# Altium project Piscina-V.02.PrjPcb
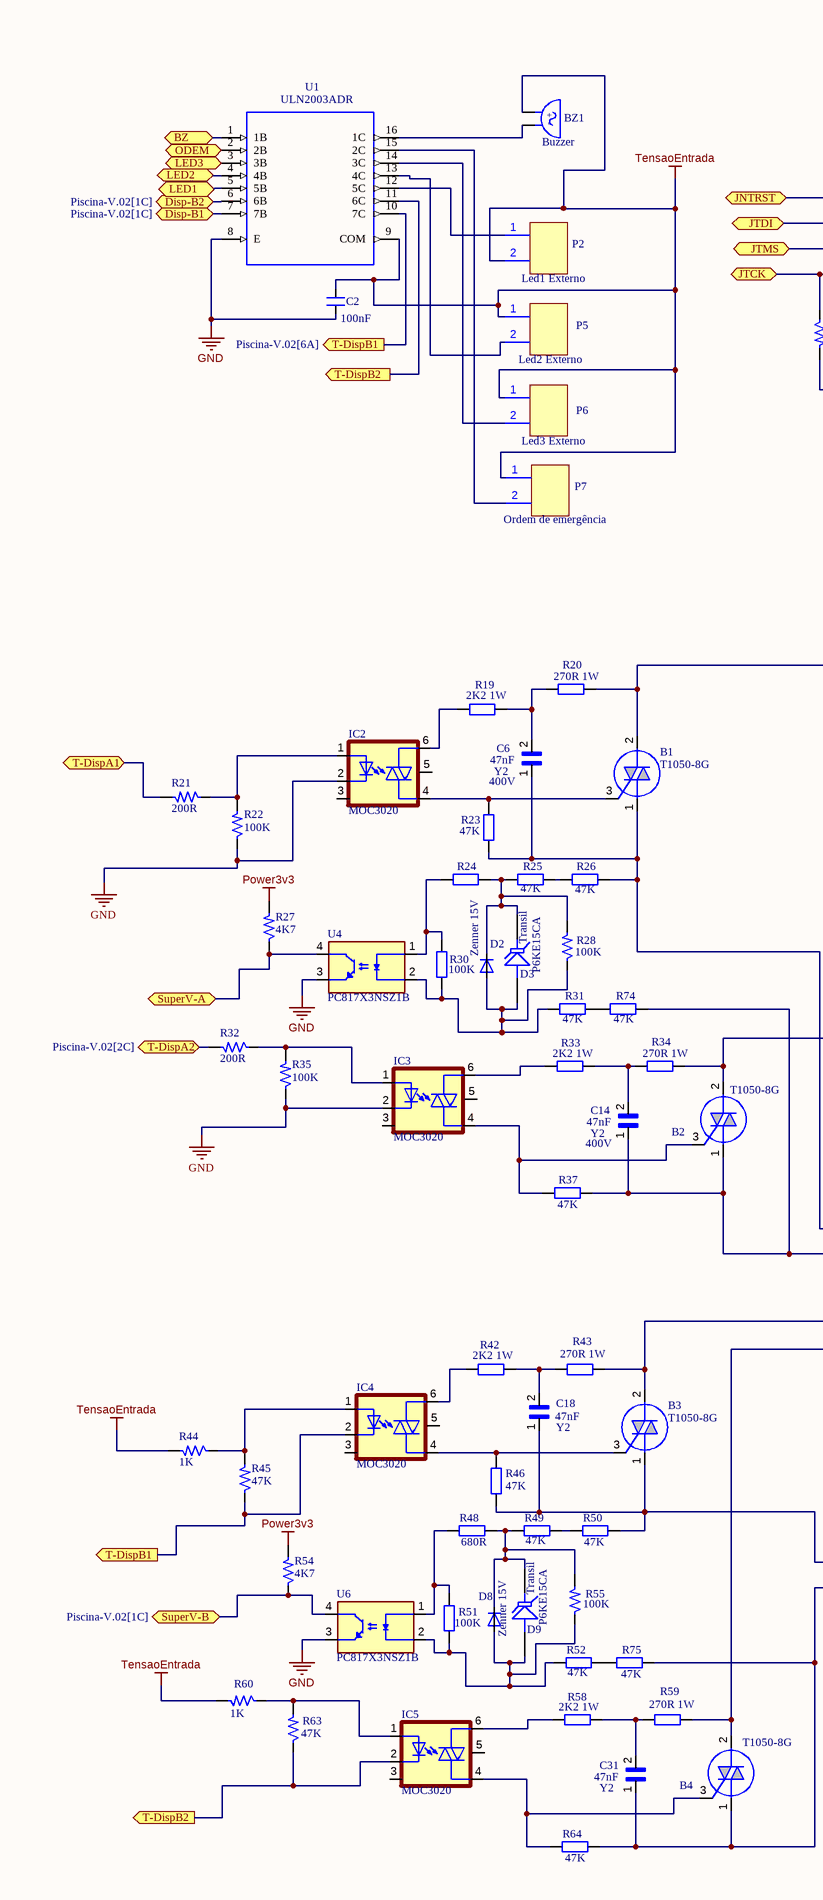
[diagram p0: Piscina-V.02.SchDoc, left]
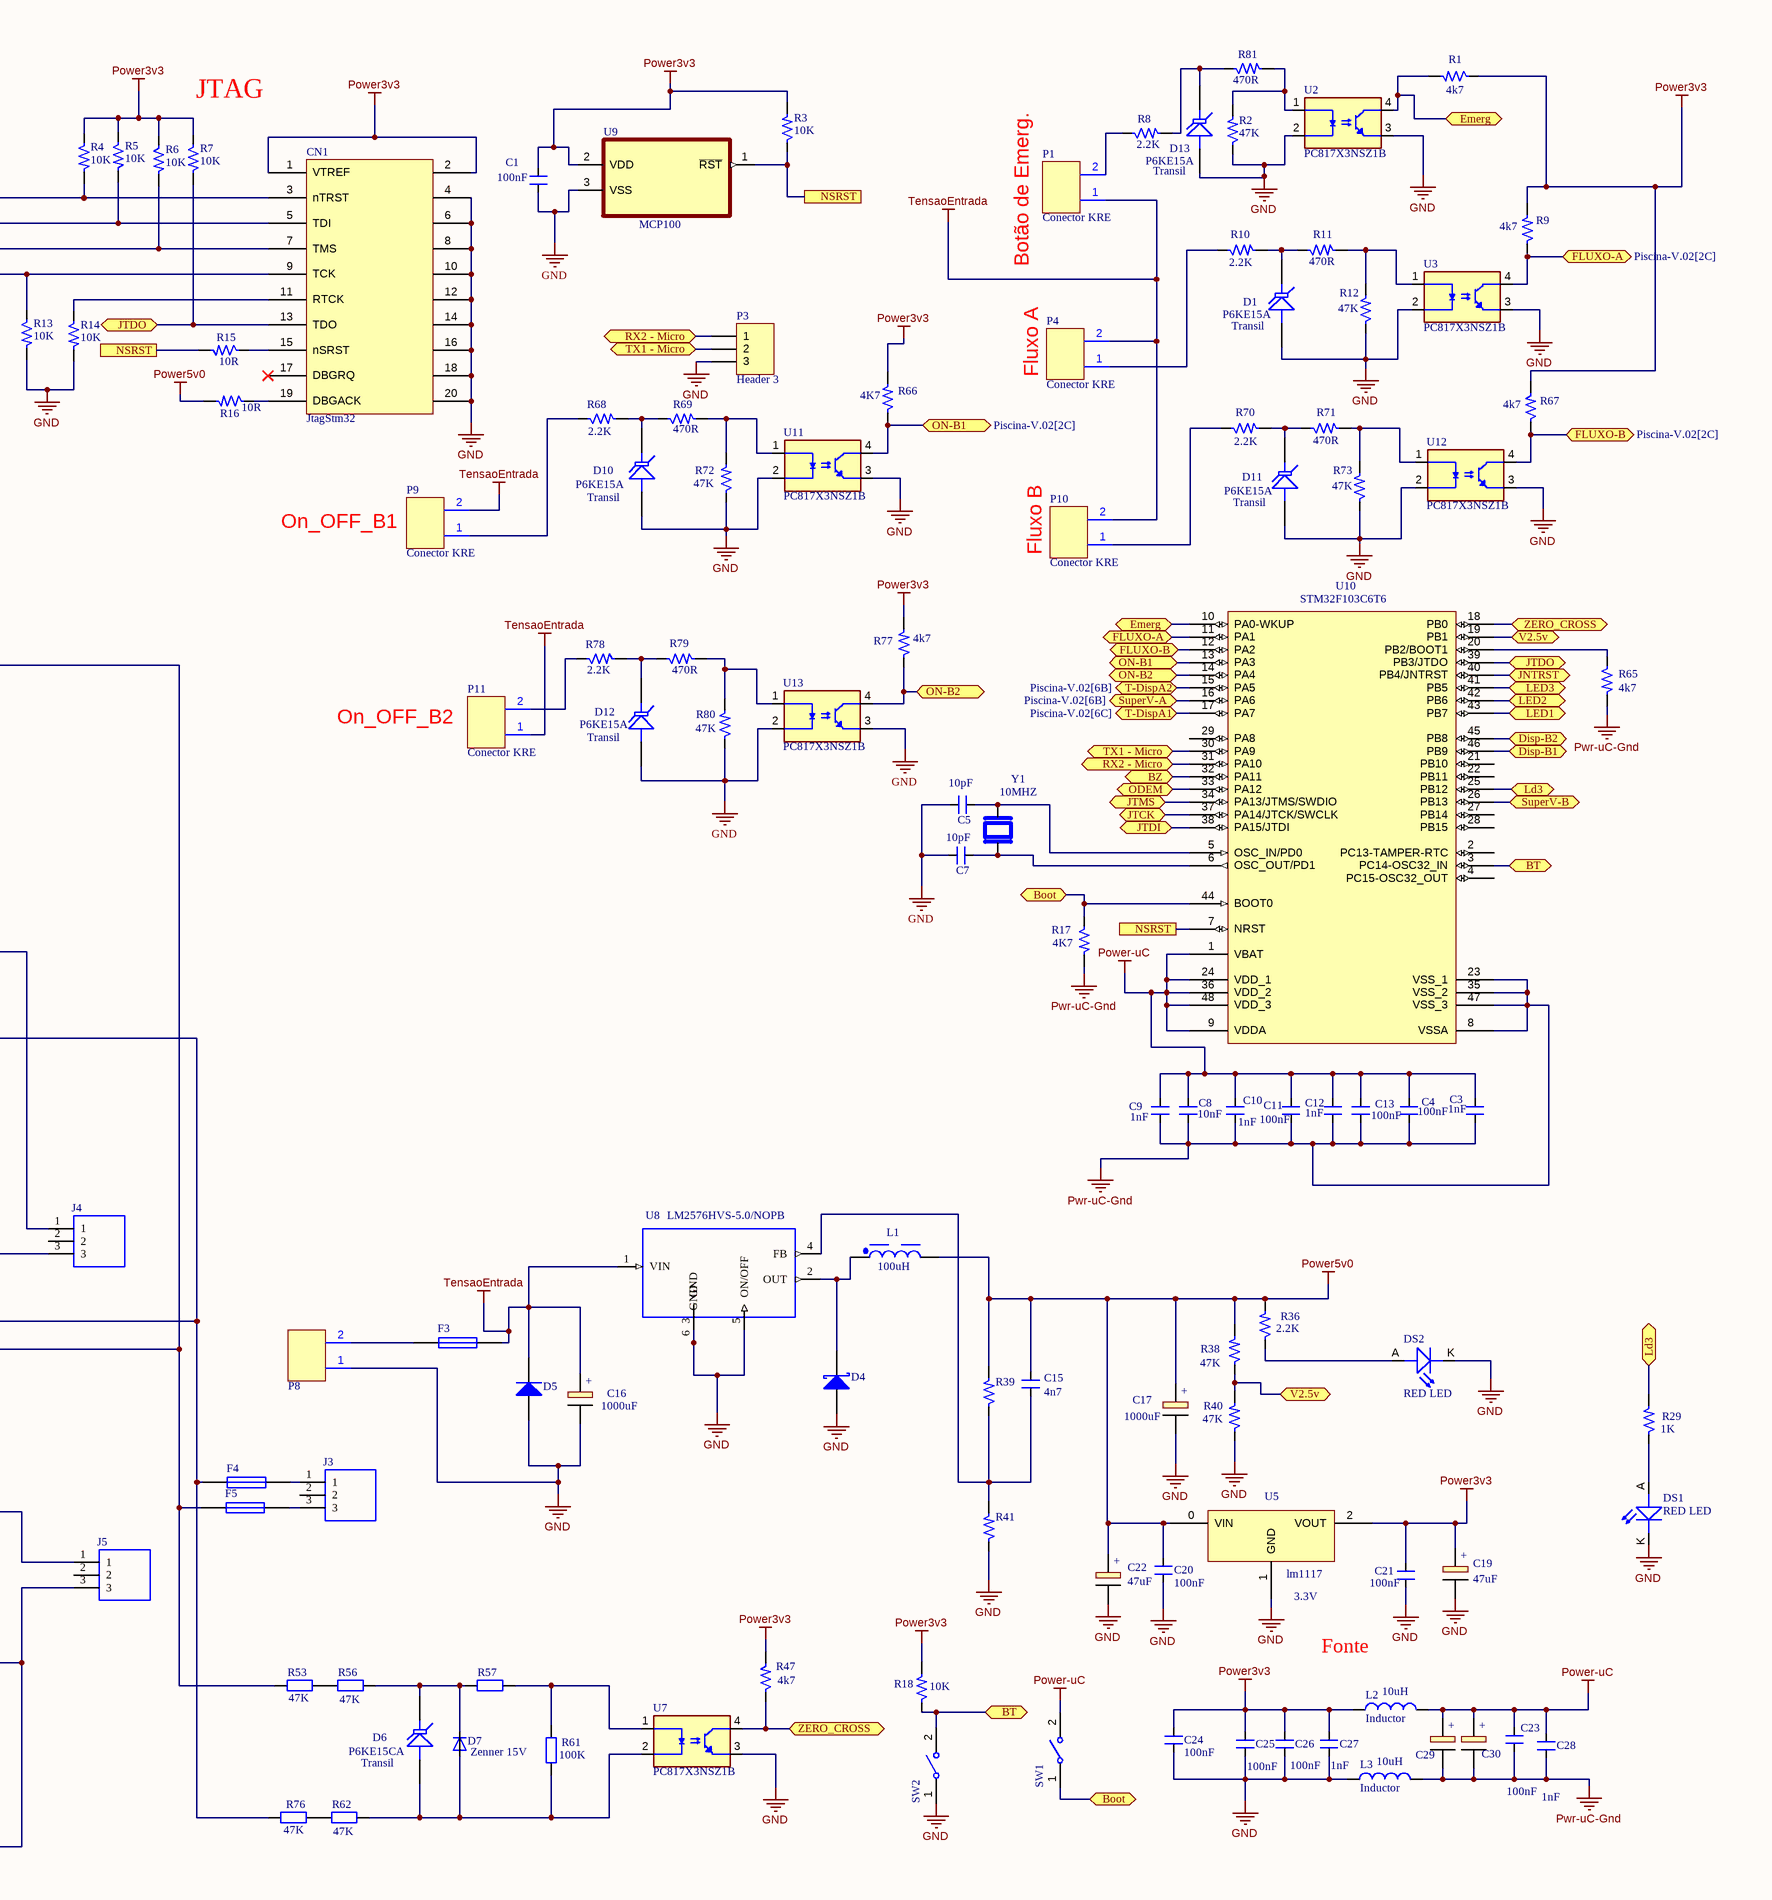
[diagram p1: Piscina-V.02.SchDoc, right]
1 sheet, 173 parts. Net scope: flat (ports and power ports of the same name join across sheets).
Board file: Piscina-V.02.PcbDoc

## Sheet Piscina-V.02.SchDoc
size C; SheetNumber: 1; SheetTotal: 1; SPICEModelCacheODWFNCHP: <root> / <DocumentId>ODWFNCHP</DocumentId> / <CacheFrame Number="0"> / <Model Name="10tq035" Kind="MDL"> / <Text>*10TQ035 MCE 3/26/98 / *Ref: IR Power Semiconductors Product Digest '94 / *MCE 35V 10A 3us pkg:TO-220 3,1 / .MODEL 10TQ035 D (IS=14.2N RS=4.2M N=1.7 BV=35 IBV=15M / + CJO=412P VJ=0.75 M=0.333 TT=4.32U EG=.69 XTI=2)</Text> / </Model> / </CacheFrame> / </root>

### Parts
B1  T1050-8G  [Triac-D²PAK]
B2  T1050-8G  [Triac-D²PAK]
B3  T1050-8G  [Triac-D²PAK]
B4  T1050-8G  [Triac-D²PAK]
BZ1  Buzzer  [Buzzer-3D]
C1  100nF  [Cap0805]
C2  100nF  [Cap0805]
C3  1nF  [Cap0805]
C4  100nF  [Cap0805]
C5  10pF  [Cap0805]
C6  47nF  [CapX2-10mm]
C7  10pF  [Cap0805]
C8  10nF  [Cap0805]
C9  1nF  [Cap0805]
C10  1nF  [Cap0805]
C11  100nF  [Cap0805]
C12  1nF  [Cap0805]
C13  100nF  [Cap0805]
C14  47nF  [CapX2-10mm]
C15  4n7  [Cap0805]
C16  1000uF  [Cap-Eletrolitico-5mm]
C17  1000uF  [Cap-Eletrolitico-5mm]
C18  47nF  [CapX2-10mm]
C19  47uF  [Cap_47uf 16V]
C20  100nF  [Cap0805]
C21  100nF  [Cap0805]
C22  47uF  [Cap_47uf 16V]
C23  100nF  [Cap0805]
C24  100nF  [Cap0805]
C25  100nF  [Cap0805]
C26  100nF  [Cap0805]
C27  1nF  [Cap0805]
C28  1nF  [Cap0805]
C29  Capacitor Eletrolitico  [Cap_47uf 16V]  (value not drawn)
C30  Capacitor Eletrolitico  [Cap_47uf 16V]  (value not drawn)
C31  47nF  [CapX2-10mm]
CN1  JtagStm32  [CN-JTAG]
D1  P6KE15A  [Diode-10mm-3D]
D2  Zenner 15V  [Diode-SOD-80]
D3  P6KE15CA  [Diode-10mm-3D]
D4  Diode 10TQ035  [MBR360]  (value not drawn)
D5  Diode 1N5408  [Diode-1N5408]  (value not drawn)
D6  P6KE15CA  [Diode-10mm-3D]
D7  Zenner 15V  [Diode-SOD-80]
D8  Zenner 15V  [Diode-SOD-80]
D9  P6KE15CA  [Diode-10mm-3D]
D10  P6KE15A  [Diode-10mm-3D]
D11  P6KE15A  [Diode-10mm-3D]
D12  P6KE15A  [Diode-10mm-3D]
D13  P6KE15A  [Diode-10mm-3D]
DS1  RED LED  [Led-smd]
DS2  RED LED  [Led-smd]
F3  Fuse 1  [PicoFuse]  (value not drawn)
F4  Fuse 1  [PicoFuse]  (value not drawn)
F5  Fuse 1  [PicoFuse]  (value not drawn)
IC2  MOC3020  [MOC3020-3D]
IC3  MOC3020  [MOC3020-3D]
IC4  MOC3020  [MOC3020-3D]
IC5  MOC3020  [MOC3020-3D]
J3  TB002-500-03OR  [Borne-3V]  (value not drawn)
J4  TB002-500-03OR  [Borne-3V]  (value not drawn)
J5  TB002-500-03OR  [Borne-3V]  (value not drawn)
L1  100uH  [Indutor SMD]
L2  Inductor  value 10uH  [Indutor_Ax]
L3  Inductor  value 10uH  [Indutor_Ax]
P1  Conector KRE  [Borne-2V]
P2  Led1 Externo  [Borne-2V]
P3  Header 3  [CN_UART]
P4  Conector KRE  [Borne-2V]
P5  Led2 Externo  [Borne-2V]
P6  Led3 Externo  [Borne-2V]
P7  Ordem de emergência  [Borne-2V]
P8  Conector KRE  [Borne-2V]  (value not drawn)
P9  Conector KRE  [Borne-2V]
P10  Conector KRE  [Borne-2V]
P11  Conector KRE  [Borne-2V]
R1  4k7  [RESC2012X65N]
R2  47K  [RESC2012X65N]
R3  10K  [RESC2012X65N]
R4  10K  [RESC2012X65N]
R5  10K  [RESC2012X65N]
R6  10K  [RESC2012X65N]
R7  10K  [RESC2012X65N]
R8  2.2K  [RESC2012X65N]
R9  4k7  [RESC2012X65N]
R10  2.2K  [RESC2012X65N]
R11  470R  [RESC2012X65N]
R12  47K  [RESC2012X65N]
R13  10K  [RESC2012X65N]
R14  10K  [RESC2012X65N]
R15  10R  [RESC2012X65N]
R16  10R  [RESC2012X65N]
R17  4K7  [RESC2012X65N]
R18  10K  [RESC2012X65N]
R19  2K2 1W  [Resistor 1-4W]
R20  270R 1W  [Resistor 1-4W]
R21  200R  [RESC2012X65N]
R22  100K  [RESC2012X65N]
R23  47K  [Resistor 1-4W]
R24  Res2  [RESC3216X71N]  (value not drawn)
R25  47K  [RESC3216X71N]
R26  47K  [RESC3216X71N]
R27  4K7  [RESC2012X65N]
R28  100K  [RESC2012X65N]
R29  1K  [RESC2012X65N]
R30  100K  [RESC2012X65N]
R31  47K  [RESC3216X71N]
R32  200R  [RESC2012X65N]
R33  2K2 1W  [Resistor 1-4W]
R34  270R 1W  [Resistor 1-4W]
R35  100K  [RESC2012X65N]
R36  2.2K  [RESC2012X65N]
R37  47K  [Resistor 1-4W]
R38  47K  [RESC2012X65N]
R39  40.2K  [RESC2012X65N]  (value not drawn)
R40  47K  [RESC2012X65N]
R41  40.2K  [RESC2012X65N]  (value not drawn)
R42  2K2 1W  [Resistor 1-4W]
R43  270R 1W  [Resistor 1-4W]
R44  1K  [RESC2012X65N]
R45  47K  [RESC2012X65N]
R46  47K  [Resistor 1-4W]
R47  4k7  [RESC2012X65N]
R48  680R  [RESC3216X71N]
R49  47K  [RESC3216X71N]
R50  47K  [RESC3216X71N]
R51  100K  [RESC2012X65N]
R52  47K  [RESC3216X71N]
R53  47K  [RESC3216X71N]
R54  4K7  [RESC2012X65N]
R55  100K  [RESC2012X65N]
R56  47K  [RESC3216X71N]
R57  Res2  [RESC3216X71N]  (value not drawn)
R58  2K2 1W  [Resistor 1-4W]
R59  270R 1W  [Resistor 1-4W]
R60  1K  [RESC2012X65N]
R61  100K  [RESC2012X65N]
R62  47K  [RESC3216X71N]
R63  47K  [RESC2012X65N]
R64  47K  [Resistor 1-4W]
R65  4k7  [RESC2012X65N]
R66  4K7  [RESC2012X65N]
R67  4k7  [RESC2012X65N]
R68  2.2K  [RESC2012X65N]
R69  470R  [RESC2012X65N]
R70  2.2K  [RESC2012X65N]
R71  470R  [RESC2012X65N]
R72  47K  [RESC2012X65N]
R73  47K  [RESC2012X65N]
R74  47K  [RESC3216X71N]
R75  47K  [RESC3216X71N]
R76  47K  [RESC3216X71N]
R77  4k7  [RESC2012X65N]
R78  2.2K  [RESC2012X65N]
R79  470R  [RESC2012X65N]
R80  47K  [RESC2012X65N]
R81  470R  [RESC2012X65N]
SW1  434121025816  [434121025816]  (value not drawn)
SW2  434121025816  [434121025816]  (value not drawn)
U1  ULN2003ADR  [ULN2003A-3D]
U2  PC817X3NSZ1B  [DIP762W50P254L495H455Q4]
U3  PC817X3NSZ1B  [DIP762W50P254L495H455Q4]
U4  PC817X3NSZ1B  [DIP762W50P254L495H455Q4]
U5  lm1117  output voltag: 3.3V  [LM1117-3D]
U6  PC817X3NSZ1B  [DIP762W50P254L495H455Q4]
U7  PC817X3NSZ1B  [DIP762W50P254L495H455Q4]
U8  LM2576HVS-5.0/NOPB  [LM2576]
U9  MCP100  [MCP100-SMD]
U10  STM32F103C6T6  [lqfp48-stm]
U11  PC817X3NSZ1B  [DIP762W50P254L495H455Q4]
U12  PC817X3NSZ1B  [DIP762W50P254L495H455Q4]
U13  PC817X3NSZ1B  [DIP762W50P254L495H455Q4]
Y1  10MHZ  [XTAL_ABLS-12.000MHz-20-B-3-H-T]

### Ports
Boot (bidir, see Piscina-V.02[2A]), Boot (bidir, see Piscina-V.02[2C]), BT (bidir, see Piscina-V.02[1C]), BT (bidir, see Piscina-V.02[2A]), BZ (bidir, see Piscina-V.02[2C]), BZ (bidir, see Piscina-V.02[6D]), Disp-B1 (bidir, see Piscina-V.02[1C]), Disp-B1 (bidir, see Piscina-V.02[6D]), Disp-B2 (bidir, see Piscina-V.02[1C]), Disp-B2 (bidir, see Piscina-V.02[6D]), Emerg (bidir, see Piscina-V.02[1D]), Emerg (bidir, see Piscina-V.02[2C]), FLUXO-A (bidir, see Piscina-V.02[1D]), FLUXO-A (bidir, see Piscina-V.02[2C]), FLUXO-B (bidir, see Piscina-V.02[1D]), FLUXO-B (bidir, see Piscina-V.02[2C]), JNTRST (bidir, see Piscina-V.02[1C]), JNTRST (bidir, see Piscina-V.02[5D]), JTCK (bidir, see Piscina-V.02[2C]), JTCK (bidir, see Piscina-V.02[5D]), JTDI (bidir, see Piscina-V.02[2C]), JTDI (bidir, see Piscina-V.02[5D]), JTDO (bidir, see Piscina-V.02[1C]), JTDO (bidir, see Piscina-V.02[4D]), JTMS (bidir, see Piscina-V.02[2C]), JTMS (bidir, see Piscina-V.02[5D]), Ld3 (bidir, see Piscina-V.02[1B]), Ld3 (bidir, see Piscina-V.02[1C]), LED1 (bidir, see Piscina-V.02[1C]), LED1 (bidir, see Piscina-V.02[6D]), LED2 (bidir, see Piscina-V.02[1C]), LED2 (bidir, see Piscina-V.02[6D]), LED3 (bidir, see Piscina-V.02[1C]), LED3 (bidir, see Piscina-V.02[6D]), NSRST (see Piscina-V.02[2C], Piscina-V.02[3D]), NSRST (see Piscina-V.02[2C], Piscina-V.02[4D]), NSRST (see Piscina-V.02[3D], Piscina-V.02[4D]), ODEM (bidir, see Piscina-V.02[2C]), ODEM (bidir, see Piscina-V.02[6D]), ON-B1 (bidir, see Piscina-V.02[2C]), ON-B1 (bidir, see Piscina-V.02[2D]), ON-B2 (bidir, see Piscina-V.02[2C]), RX2 - Micro (bidir, see Piscina-V.02[2C]), RX2 - Micro (bidir, see Piscina-V.02[3D]), SuperV-A (bidir, see Piscina-V.02[2C]), SuperV-A (bidir, see Piscina-V.02[6B]), SuperV-B (bidir, see Piscina-V.02[1C]), SuperV-B (bidir, see Piscina-V.02[6A]), T-DispA1 (bidir, see Piscina-V.02[2C]), T-DispA1 (bidir, see Piscina-V.02[6C]), T-DispA2 (bidir, see Piscina-V.02[2C]), T-DispA2 (bidir, see Piscina-V.02[6B]), T-DispB1 (out, see Piscina-V.02[6A]), T-DispB1 (out, see Piscina-V.02[6D]), T-DispB2 (out, see Piscina-V.02[6A]), T-DispB2 (out, see Piscina-V.02[6D]), TX1 - Micro (bidir, see Piscina-V.02[2C]), TX1 - Micro (bidir, see Piscina-V.02[3D]), V2.5v (bidir, see Piscina-V.02[1C]), V2.5v (bidir, see Piscina-V.02[2B]), ZERO_CROSS (bidir, see Piscina-V.02[1C]), ZERO_CROSS (bidir, see Piscina-V.02[3A])

### Nets
GND: C1.1 C2.1 C5.2 C7.2 C16.Negativo C17.Negativo C19.Negativo C20.1 C21.1 C22.Negativo C24.1 C25.1 C26.1 C27.1 CN1.4(GND) CN1.6(GND) CN1.8(GND) CN1.10(GND) CN1.12(GND) CN1.14(GND) CN1.16(GND) CN1.18(GND) CN1.20(GND) D1.1(A) D4.Anodo(Catodo) D5.1(A) D10.1(A) D11.1(A) D12.1(A) D13.1(A) DS1.K(CATHODE) DS2.K(CATHODE) IC2.2(C) IC3.2(C) L3.1 P3.3 P8.1 R2.1 R12.1 R13.2 R14.2 R22.1 R35.1 R40.1 R41.1 R72.1 R73.1 R80.1 SW2.1 U1.8(E) U2.2(CATHODE) U2.3(EMITTER) U3.2(CATHODE) U3.3(EMITTER) U4.3(EMITTER) U5.1(GND) U6.3(EMITTER) U7.3(EMITTER) U8.3(GND) U8.5(ON/OFF) U8.6(GND) U9.3(VSS) U11.2(CATHODE) U11.3(EMITTER) U12.2(CATHODE) U12.3(EMITTER) U13.2(CATHODE) U13.3(EMITTER)
Power3v3: C1.2 C19.Positivo C21.2 C24.2 C25.2 C26.2 C27.2 CN1.1(VTREF) CN1.2(GND) L2.1 R1.1 R3.2 R4.1 R5.1 R6.1 R7.1 R9.2 R18.2 R27.2 R47.2 R54.2 R66.2 R67.2 R77.2 U5.2(VOUT) U9.2(VDD)
Power5v0: C15.2 C17.Positivo C20.2 C22.Positivo L1.2 R16.2 R36.2 R38.2 R39.2 U5.0(VIN)
Power-uC: C3.2 C4.2 C8.2 C9.2 C10.2 C11.2 C12.2 C13.2 C23.2 C28.2 C29.Positivo C30.Positivo L2.2 SW1.2 U10.1(VBAT) U10.9(VDDA) U10.24(VDD_1) U10.36(VDD_2) U10.48(VDD_3)
Pwr-uC-Gnd: C3.1 C4.1 C8.1 C9.1 C10.1 C11.1 C12.1 C13.1 C23.1 C28.1 C29.Negativo C30.Negativo L3.2 R17.2 R65.2 U10.8(VSSA) U10.23(VSS_1) U10.35(VSS_2) U10.47(VSS_3)
TensaoEntrada: BZ1.POS C2.2 C16.Positivo D5.2(K) F3.2 P1.1 P2.2 P4.2 P5.1 P6.1 P7.1 P9.2 P10.2 P11.1 R44.2 R60.2 U1.9(COM) U8.1(VIN)
NetB1_1: B1.1(MT1) C6.1 J4.1 R23.2 R26.2
NetB1_2: B1.2(MT2) B4.2(MT2) F5.1 R20.2 R53.2 R59.2
NetB1_3: B1.3(G) IC2.4(A1) R23.1
NetB2_1: B2.1(MT1) C14.1 J4.3 R37.1 R74.1
NetB2_2: B2.2(MT2) B3.2(MT2) F4.1 R34.2 R43.2 R76.2
NetB2_3: B2.3(G) IC3.4(A1) R37.2
NetB3_1: B3.1(MT1) C18.1 J5.1 R46.2 R50.1
NetB3_3: B3.3(G) IC4.4(A1) R46.1
NetB4_1: B4.1(MT1) C31.1 J5.3 R64.1 R75.1
NetB4_3: B4.3(G) IC5.4(A1) R64.2
NetBZ1_NEG: BZ1.NEG U1.16(1C)
NetC5_1: C5.1 U10.5(OSC_IN/PD0) Y1.1
NetC6_2: C6.2 R19.2 R20.1
NetC7_1: C7.1 U10.6(OSC_OUT/PD1) Y1.2
NetC14_2: C14.2 R33.2 R34.1
NetC15_1: C15.1 R39.1 R41.2 U8.4(FB)
NetC18_2: C18.2 R42.2 R43.1
NetC31_2: C31.2 R58.2 R59.1
NetCN1_3: CN1.3(nTRST) R4.2 U10.40(PB4/JNTRST) ; port JNTRST
NetCN1_5: CN1.5(TDI) R5.2 U10.38(PA15/JTDI) ; port JTDI
NetCN1_7: CN1.7(TMS) R6.2 U10.34(PA13/JTMS/SWDIO) ; port JTMS
NetCN1_9: CN1.9(TCK) R13.1 U10.37(PA14/JTCK/SWCLK) ; port JTCK
NetCN1_11: CN1.11(RTCK) R14.1
NetCN1_13: CN1.13(TDO) R7.2 U10.39(PB3/JTDO) ; port JTDO
NetCN1_15: CN1.15(nSRST) R15.1
NetCN1_19: CN1.19(DBGACK) R16.1
NetD1_2: D1.2(K) R10.2 R11.1
NetD2_A: D2.A D3.1(A) R28.1 R30.1 R31.2 U4.2(CATHODE)
NetD2_C: D2.C D3.2(K) R24.2 R25.1 R28.2
NetD4_Catodo: D4.Catodo(Anodo) L1.1 U8.2(OUT)
NetD6_1: D6.1(A) D7.A R61.2 R62.1 U7.2(CATHODE)
NetD6_2: D6.2(K) D7.C R56.1 R57.2
NetD8_A: D8.A D9.1(A) R51.1 R52.2 R55.1 U6.2(CATHODE)
NetD8_C: D8.C D9.2(K) R48.2 R49.2 R55.2
NetD10_2: D10.2(K) R68.2 R69.1
NetD11_2: D11.2(K) R70.2 R71.1
NetD12_2: D12.2(K) R78.2 R79.1
NetD13_2: D13.2(K) R8.2 R81.1
NetDS1_A: DS1.A(ANODE) R29.1
NetDS2_A: DS2.A(ANODE) R36.1
NetF3_1: F3.1 P8.2
NetF4_2: F4.2 J3.1
NetF5_2: F5.2 J3.3
NetIC2_1: IC2.1(A) R21.1 R22.2
NetIC2_6: IC2.6(A2) R19.1
NetIC3_1: IC3.1(A) R32.1 R35.2
NetIC3_6: IC3.6(A2) R33.1
NetIC4_1: IC4.1(A) R44.1 R45.2
NetIC4_2: IC4.2(C) R45.1 U1.10(7C) ; port T-DispB1
NetIC4_6: IC4.6(A2) R42.1
NetIC5_1: IC5.1(A) R60.1 R63.2
NetIC5_2: IC5.2(C) R63.1 U1.11(6C) ; port T-DispB2
NetIC5_6: IC5.6(A2) R58.1
NetP1_2: P1.2 R8.1
NetP2_1: P2.1 U1.12(5C)
NetP3_1: P3.1 U10.31(PA10) ; port RX2 - Micro
NetP3_2: P3.2 U10.30(PA9) ; port TX1 - Micro
NetP4_1: P4.1 R10.1
NetP5_2: P5.2 U1.13(4C)
NetP6_2: P6.2 U1.14(3C)
NetP7_2: P7.2 U1.15(2C)
NetP9_1: P9.1 R68.1
NetP10_1: P10.1 R70.1
NetP11_2: P11.2 R78.1
NetR1_2: R1.2 U2.4(COLLECTOR) U10.10(PA0-WKUP) ; port Emerg
NetR2_2: R2.2 R81.2 U2.1(ANODE)
NetR3_1: R3.1 R15.2 U9.1(~{RST}) U10.7(NRST) ; port NSRST
NetR9_1: R9.1 U3.4(COLLECTOR) U10.11(PA1) ; port FLUXO-A
NetR11_2: R11.2 R12.2 U3.1(ANODE)
NetR17_1: R17.1 SW1.1 U10.44(BOOT0) ; port Boot
NetR18_1: R18.1 SW2.2 U10.3(PC14-OSC32_IN) ; port BT
NetR21_2: R21.2 U10.17(PA7) ; port T-DispA1
NetR24_1: R24.1 R30.2 U4.1(ANODE)
NetR25_2: R25.2 R26.1
NetR27_1: R27.1 U4.4(COLLECTOR) U10.16(PA6) ; port SuperV-A
NetR29_2: R29.2 U10.25(PB12) ; port Ld3
NetR31_1: R31.1 R74.2
NetR32_2: R32.2 U10.15(PA5) ; port T-DispA2
NetR38_1: R38.1 R40.2 U10.19(PB1) ; port V2.5v
NetR47_1: R47.1 U7.4(COLLECTOR) U10.18(PB0) ; port ZERO_CROSS
NetR48_1: R48.1 R51.2 U6.1(ANODE)
NetR49_1: R49.1 R50.2
NetR52_1: R52.1 R75.2
NetR53_1: R53.1 R56.2
NetR54_1: R54.1 U6.4(COLLECTOR) U10.26(PB13) ; port SuperV-B
NetR57_1: R57.1 R61.1 U7.1(ANODE)
NetR62_2: R62.2 R76.1
NetR65_1: R65.1 U10.20(PB2/BOOT1)
NetR66_1: R66.1 U10.13(PA3) U11.4(COLLECTOR) ; port ON-B1
NetR67_1: R67.1 U10.12(PA2) U12.4(COLLECTOR) ; port FLUXO-B
NetR69_2: R69.2 R72.2 U11.1(ANODE)
NetR71_2: R71.2 R73.2 U12.1(ANODE)
NetR77_1: R77.1 U10.14(PA4) U13.4(COLLECTOR) ; port ON-B2
NetR79_2: R79.2 R80.2 U13.1(ANODE)
NetU1_1: U1.1(1B) U10.32(PA11) ; port BZ
NetU1_2: U1.2(2B) U10.33(PA12) ; port ODEM
NetU1_3: U1.3(3B) U10.41(PB5) ; port LED3
NetU1_4: U1.4(4B) U10.42(PB6) ; port LED2
NetU1_5: U1.5(5B) U10.43(PB7) ; port LED1
NetU1_6: U1.6(6B) U10.45(PB8) ; port Disp-B2
NetU1_7: U1.7(7B) U10.46(PB9) ; port Disp-B1

Not connected (* = marked no-connect by the designer): CN1 17(DBGRQ)*; IC2 3(P$1) 5(P$2); IC3 3(P$1) 5(P$2); IC4 3(P$1) 5(P$2); IC5 3(P$1) 5(P$2); J3 2; J4 2; J5 2; U10 2(PC13-TAMPER-RTC) 4(PC15-OSC32_OUT) 21(PB10) 22(PB11) 27(PB14) 28(PB15) 29(PA8)

### Notes on the sheet
- JTAG
- (near D13) Transil
- (near P1) Botão de Emerg.
- (near D1) Transil
- (near P4) Fluxo A
- On_OFF_B1
- (near D10) Transil
- (near D11) Transil
- (near P10) Fluxo B
- On_OFF_B2
- 400V
- Y2
- (near D12) Transil
- (near D3) Transil
- (near C14) 400V
- (near C14) Y2
- (near C18) Y2
- (near D9) Transil
- Fonte
- (near C31) Y2
- (near D6) Transil
- DWG. NO.
- REV.
- SHT.
- THIS DOCUMENT AND THE DATA DISCLOSED HEREIN OR HEREWITH IS THE PROPERTY OF ALTIUM LIMITED AND MAY BE FREELY DISTRIBUTED IN WHOLE. NO RIGHTS ARE RESERVED OR EXPRESS OR IMPLIED WARANTEE GIVEN.
- REVISION
- DESCRIPTION
- DATE
- APPROVED
- ENG:
- APPROVALS
- PROJECT
- DSN:
- CHK:
- REFERENCE DOCUMENTS
- PROJECT REVISION:
- TITLE
- DOCUMENT REVISION:
- DESIGN ITEM:
- BOM:
- FAB DWG:
- PCB DWG:
- ASSY DWG:
- SCALE:
- SIZE
- B
- CAGE CODE
- FILE NAME
- DWG NO.
- SHEET
- OF
- REV
- (in symbol Cap_47uf 16V) +
- (in symbol WST-1205S) +; -

### Library data of the parts
B1-B4 = T1050-8G: 800V, 10A Snubberless? Triac in D2PAK; Manufacturer_Name: STMicroelectronics; Geometry.Height: 4.83mm; Manufacturer_Part_Number: T1050-8G; Arrow Part Number: T1050-8G; Arrow Price/Stock: https://www.arrow.com/en/products/t1050-8g/stmicroelectronics; Datasheet Link: https://www.st.com/resource/en/datasheet/btb10.pdf
BZ1 = WST-1205S: Buzzer 2.3khz 4-6vdc Pcb Wash; MF: Soberton Inc.; MP: WST-1205S; Price: None; SnapEDA_Link: https://www.snapeda.com/parts/WST-1205S/Soberton%20Inc./view-part/?ref=snap; Package: Soberton Inc.; Availability: Unavailable; Value: *
C1-C5 C7-C13 C15 C21 C23 C25-C28 = CAP_100nF-25V-10%-0805: 0.1µF ±10% 25V Ceramic Capacitor X7R 0805 (2012 Metric); Manufacturer: Yageo; Manufacturer Part Number: CC0805KRX7R8BB104; Case/Package: 0805; Supplier-1: Digikey
C6 C14 C18 C31 = Cap-10mm: MP: ECQE6153KF; Package: None; Availability: Unavailable; Price: None; Value: *
C16 C17 C19 C22 = Cap_47uf 16V: Capacitor Eletrolitico
C20 C24 = CAP_10uF-25V-10%-0805: 10µF ±10% 25V Ceramic Capacitor X5R 0805 (2012 Metric); Manufacturer: Murata Electronics; Manufacturer Part Number: GRM21BR61E106KA73K; Case/Package: 0805; Supplier-1: Digikey
C29 C30 = Cap_47uf 16V
D1 D3 D6 D9-D13 = Tranzorb: Transient Voltage Suppression (TVS) Diode; Published: 24-Mar-1999; LatestRevisionDate: 17-Jul-2002; LatestRevisionNote: Re-released for DXP Platform.; PackageReference: DO-7; Publisher: Altium Limited; PackageDescription: Axial Lead Diode
D2 D7 D8 = DL4148-TP: Diode Standard 75V 150mA Surface Mount Mini MELF; MF: Micro Commercial; MP: DL4148-TP; Value: *; SnapEDA_Link: https://www.snapeda.com/parts/DL4148-TP/Micro%20Commercial/view-part/231264/?ref=snap; Price: None; Package: DO-213 MCC; Availability: Unavailable
D4 = Diode 10TQ035: Schottky Rectifier; Note: Terminal 2 is the TAB and is electrically connected to the cathode; Published: 8-Jun-2000; LatestRevisionDate: 17-Jul-2002; LatestRevisionNote: Re-released for DXP Platform.; DatasheetVersion: PD-2.057B; PackageVersion: Feb-1998; PackageReference: TO-220AC; Publisher: Altium Limited; PackageDescription: TO, Thru-Hole, Vertical, Heatsink Mounted; 3 In-Line Leads (1 Absent); Pitch 2.54 mm; ComponentLink1Description: Manufacturer Link; ComponentLink1URL: http://www.irf.com/; ComponentLink2Description: Datasheet; ComponentLink2URL: http://www.irf.com/product-info/datasheets/data/10tq.pdf
D5 = Diode 1N5408: 3 Amp Medium Power Silicon Rectifier Diode; Published: 8-Jun-2000; LatestRevisionDate: 17-Jul-2002; LatestRevisionNote: Re-released for DXP Platform.; DatasheetVersion: Aug-1984; PackageReference: DO-201AD; Publisher: Altium Limited; PackageDescription: Diode, Axial; Body 9.5 x 5.3 mm (LxDia. max), Lead Dia. 1.32 mm (max); ComponentLink1Description: Manufacturer Link; ComponentLink1URL: http://www.irf.com/
DS1 DS2 = LED_RED-2V-20mA-0805: Red 631nm LED Indication - Discrete 2V 0805 (2012 Metric); Manufacturer: Vishay Lite-On; Manufacturer Part Number: LTST-C171KRKT; Case/Package: 0805; Supplier-1: SP ROAD
F3-F5 = Fuse 1: Fuse; Published: 8-Jun-2000; LatestRevisionDate: 17-Jul-2002; LatestRevisionNote: Re-released for DXP Platform.; PackageReference: PIN-W2/E2.8; Publisher: Altium Limited; PackageDescription: Thru-Hole; 2 Leads
IC2-IC5 = MOC3020: Optoisolator Triac Output 5300Vrms 1 Channel 6-DIP; MF: ON Semiconductor; SnapEDA_Link: https://www.snapeda.com/parts/MOC3020/ON%20Semiconductor/view-part/2780094/?ref=snap; MP: MOC3020; Availability: Unavailable; Price: None; Value: *; Package: DIP-6 ON Semiconductor
J3-J5 = TB002-500-03OR: 2~24 Poles, Screw Type, Horizontal, 5.0 Pitch, 22~12 _AWG_, Terminal Block Connector; MF: CUI; SnapEDA_Link: https://www.snapeda.com/parts/TB002-500-03OR/CUI/view-part/?ref=snap; Availability: Unavailable; Price: None; CUI_purchase_URL: https://www.cui.com/product/interconnect/connectors/terminal-blocks/tb002-500-series?utm_source=snapeda.com&utm_medium=referral&utm_campaign=snapedaBOM; MP: TB002-500-03OR; Package: None; Value: *
L1 = 74477001: WE-PD SMT Power Inductor, size 1280, 1.2uH, 13.5A, 7mOhm; Manufacturer: Wurth Elektronik; Case/Size Code: 1280; DC Resistance: 4.6mOhm; Saturation Current: 21A; Self Resonant Frequency: 45MHz; Type: Standard; Manufacturer Part Number: 74477001; Category: Power Inductors; Match Code: WE-PD; ComponentLink1Description: Website Link; ComponentLink1URL: https://www.we-online.com/redexpert/article/74477001?ad; ComponentLink2Description: Datasheet Link; ComponentLink2URL: https://www.we-online.com/redexpert/spec/74477001?ad; Mount: Surface Mount; Operating Temperature Max: 125°C; Operating Temperature Min: -40°C; Packaging: Tape and Reel; Length: 12mm; Width: 12mm; Height: 8mm; DC Resistance Max: 7mOhm; Inductance: 1.2uH; Rated Current: 13.5A
L2 L3 = Inductor: Code_IEC: 1005; Published: 8-Jun-2000; LatestRevisionDate: 29-May-2009; LatestRevisionNote: IPC-7351 Footprint Added.; PackageReference: 0402-A; Publisher: Altium Limited; PackageDescription: Chip Inductor; Code_JEITA: 0402
P2 P5-P7 = Conector KRE
P3 = Header 3: Header, 3-Pin; LatestRevisionDate: 17-Jul-2002; LatestRevisionNote: Re-released for DXP Platform.; Publisher: Altium Limited
R1-R18 R21 R22 R27-R29 R32 R35 R36 R38-R41 R44 R45 R47 R54 R55 R60 R63 R65-R73 R77-R81 = RES_40.2K-0.125W-1%-0805: 40.2 kOhms ±1% 0.125W, 1/8W Chip Resistor 0805 (2012 Metric) Automotive AEC-Q200 Thick Film; Manufacturer: TE Connectivity; Manufacturer Part Number: RMCF0805FT40K2; Alternate Part Number-1: NA; Case/Package: 0805; Supplier-1: SIRICOM; Supplier Part Number-1: WR08X4022FTL; Category: Resistor; Number of Pins: 2
R19 R20 R23-R26 R30 R31 R33 R34 R37 R42 R43 R46 R48-R53 R56-R59 R61 R62 R64 R74-R76 = Res2: Resistor; Value: 1K; Published: 8-Jun-2000; LatestRevisionDate: 17-Jul-2002; LatestRevisionNote: Re-released for DXP Platform.; PackageReference: AXIAL-0.4; Publisher: Altium Limited; PackageDescription: Axial Device, Thru-Hole; 2 Leads; 0.4 in Pin Spacing
SW1 SW2 = 434121025816: WS-TASV SMT Tact Switch, 6mm x 3.8mm, 160gf, SPST-NO, 12V, 50mA; Manufacturer: Wurth Elektronik; Washable: No; Manufacturer Part Number: 434121025816; Category: Tact Switch; Match Code: WS-TASV; ComponentLink1Description: Website Link; ComponentLink1URL: https://www.we-online.com/redexpert/article/434121025816?ad; ComponentLink2Description: Datasheet Link; ComponentLink2URL: https://www.we-online.com/redexpert/spec/434121025816?ad; Mount: Surface Mount; Min Operating Temperature: -40°C; Max Operating Temperature: 85°C; Packaging: Tape and Reel; Length: 6mm; Width: 3.8mm; Height: 2.5mm; Circuit: SPST-NO; Contact Material: Stainless Steel; Contact Plating: Silver; Operation Force: 160gf; Rated Current: 50mA; Rated Voltage (DC): 12V; Terminal Material: Copper Alloy; Terminal Plating: Silver
U1 = ULN2003ADR: PARTCOUNT=2; MF: Texas Instruments; SnapEDA_Link: https://www.snapeda.com/parts/ULN2003ADR/Texas%20Instruments/view-part/?ref=snap; Availability: Unavailable; MP: ULN2003ADR; Price: None; Package: SOIC-16 STMicroelectronics; Value: *
U2-U4 U6 U7 U11-U13 = PC817X3NSZ1B: Optoisolator Transistor Output - 1 Channel 4-DIP; MF: Sharp Microelectronics; SnapEDA_Link: https://www.snapeda.com/parts/PC817X3NSZ1B/Sharp+Microelectronics/view-part/?ref=snap; Price: None; Purchase-URL: https://pricing.snapeda.com/search/part/PC817X3NSZ1B/?ref=eda; Check_prices: https://www.snapeda.com/parts/PC817X3NSZ1B/Sharp+Microelectronics/view-part/?ref=eda; MP: PC817X3NSZ1B; Value: *; Availability: In Stock; Package: DIP-4 Sharp Microelectronics
U5 = lm1117: The LM1117 is a low dropout voltage regulator with a / dropout of 1.2 V at 800 mA of load current. / The LM1117 is available in an adjustable version, / which can set the output voltage from 1.25 to 13.8 V / with only two external resistors. In addition, it is / available in five fixed voltages, 1.8 V, 2.5 V, 3.3 V, / and 5 V. / The LM1117 offers current limiting and thermal / shutdown. Its circuit includes a Zener trimmed / bandgap reference to assure output voltage accuracy / to within ±1%. / A minimum of 10-µF tantalum capacitor is required at / the output to improve the transient response and / stability.; ComponentLink1Description: datasheet; ComponentLink1URL: https://www.ti.com/lit/gpn/lm1117
U8 = LM2576HVS-5.0/NOPB: SIMPLE SWITCHER%3F 40V%2C 3A Low Component Count Step-Down Regulator 5-DDPAK/TO-263 -40 to 125; MF: Texas Instruments; MP: LM2576SX-ADJ/NOPB; Price: 1.87 USD; Package: TO-263-5 Texas Instruments; Availability: Good; Value: *
U9 = MCP100T-270I/TT: Supervisor Push-Pull, Ð¢Ð¾Ñ‚ÐµÐ¼Ð½Ñ‹Ð¹ ÑÑ‚Ð¾Ð»Ð±, 1 ÐºÐ°Ð½Ð°Ð», SOT-23-3; MF: Microchip; Package: SOT-23-3 Microchip; Availability: Unavailable; Value: *; MP: MCP100T-270I/TT; SnapEDA_Link: https://www.snapeda.com/parts/MCP100T-270I/TT/Microchip/view-part/457931/?ref=snap; Price: None
U10 = STM32F103C6T6: STM32 ARM-based 32-bit MCU with 32 Kbytes Flash, 48-pin LQFP, Industrial Temperature; Published: 30-May-2008; DatasheetVersion: rev6, Mar-2008; PackageVersion: Mar-2008; PackageReference: LQFP48; Publisher: Altium Limited; PackageDescription: 48-Pin Low-Profile Quad Flat Pack, 7 x 7 mm Body, 0.5 mm Pitch (LQFP48); ComponentLink1Description: Manufacturer Link; ComponentLink1URL: www.st.com/stm32; ComponentLink2Description: Datasheet; ComponentLink2URL: http://www.st.com/stonline/products/literature/ds/13587.pdf
Y1 = ABLS-12.000MHz-20-B-3-H-T: HC/49US (AT49) SMD LOW PROFILE CRYSTAL; MF: Abracon LLC; SnapEDA_Link: https://www.snapeda.com/parts/ABLS-12.000MHZ-20-B-3-H-T/Abracon+LLC/view-part/?ref=snap; Check_prices: https://www.snapeda.com/parts/ABLS-12.000MHZ-20-B-3-H-T/Abracon+LLC/view-part/?ref=eda; Digi-Key_Part_Number: 535-15006-2-ND; Package: None; Purchase-URL: https://pricing.snapeda.com/search/part/ABLS-12.000MHZ-20-B-3-H-T/?ref=eda; Value: *; MP: ABLS-12.000MHZ-20-B-3-H-T